# EAGLE schematic rcplugs-esp12-v001 (EAGLE 7.5.0)
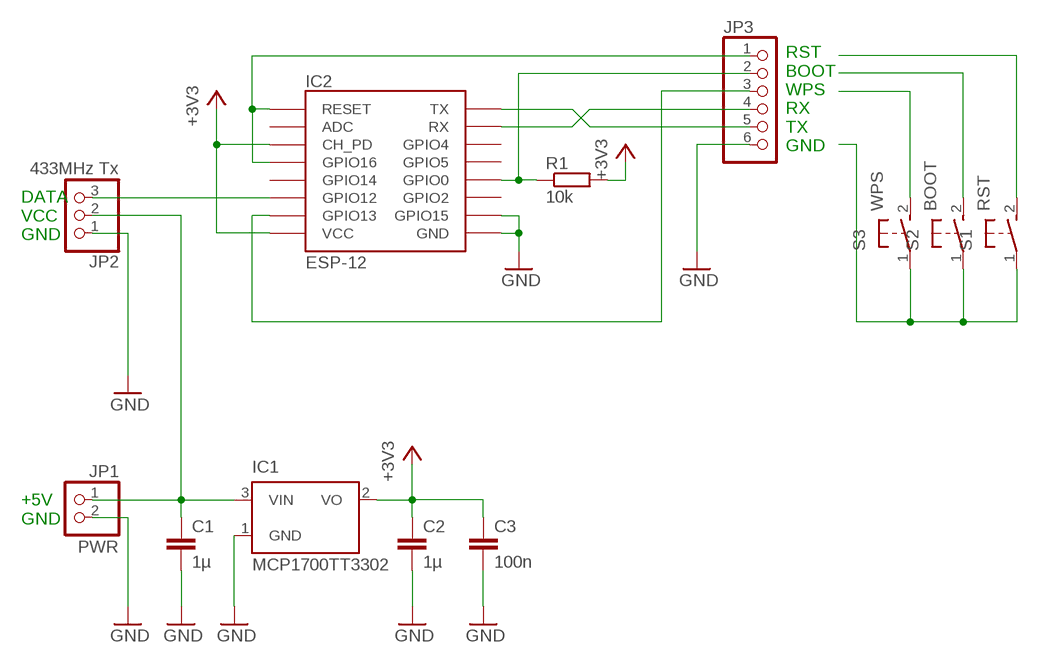
[diagram p0: schematic, sheet 1]

## Parts
C1  1µ  C-EUC0805  [C0805]
C2  1µ  C-EUC0805  [C0805]
C3  100n  C-EUC0805  [C0805]
IC1  MCP1700TT3302  MCP1700TT  [SOT23]
IC2  ESP-12  [ESP-12]
JP1  PWR  PINHD-1X2  [1X02]
JP2  433MHz Tx  PINHD-1X3  [1X03]
JP3  PINHD-1X6  [1X06]
R1  10k  R-EU_R0805HS  [R0805HS]
S1  RST  TS1  [TS1]
S2  BOOT  TS1  [TS1]
S3  WPS  TS1  [TS1]

## Nets
+3V3: C2.1 C3.1 IC1.2(VO) IC2.CH_PD IC2.VCC R1.2
GND: C1.2 C2.2 C3.2 IC1.1(GND) IC2.GND IC2.GPIO15 JP1.2 JP2.1 JP3.6
N$1: C1.1 IC1.3(VIN) JP1.1 JP2.2
N$2: IC2.TX JP3.5
N$3: IC2.RX JP3.4
N$4: IC2.GPIO16 IC2.RESET JP3.1
N$5: IC2.GPIO12 JP2.3
N$6: IC2.GPIO0 JP3.2 R1.1
N$7: S3.2
N$8: IC2.GPIO13 JP3.3
N$9: S2.2
N$10: S1.2
N$12: S1.1 S2.1 S3.1
Unconnected: IC2.ADC IC2.GPIO2 IC2.GPIO4 IC2.GPIO5 IC2.GPIO14

## Notes on the sheet
- RST
  BOOT
  WPS
  RX
  TX
  GND
- DATA
  VCC
  GND
- +5V
  GND

## Library data of the parts
C1-C3 = rcl:C-EU: CAPACITOR, European symbol
IC1 = mr-microchip:MCP1700: 1.2V to 5.0V low dropout voltage regulator The MCP1700 is a family of CMOS low dropout (LDO) voltage regulators that can deliver up to 250 mA of current while consuming only 1.6 μA of quiescent current (typical). Source: http://www.microchip.com
IC2 = esp8266modules:ESP-12: ESP8266 Wifi module 12
JP1 = mr-con:PINHD-1X2: PIN HEADER
JP2 = mr-con:PINHD-1X3: PIN HEADER
JP3 = mr-con:PINHD-1X6: PIN HEADER
R1 = mr-rcl:R-EU_: RESISTOR, European symbol
S1-S3 = mr-switch:TS1: SWITCH 1 pole, 2 pins; POLLIN: 420 502